# Altium schematic sheet Main_MCU.SchDoc
size A; SheetNumber: 2; SheetTotal: 6
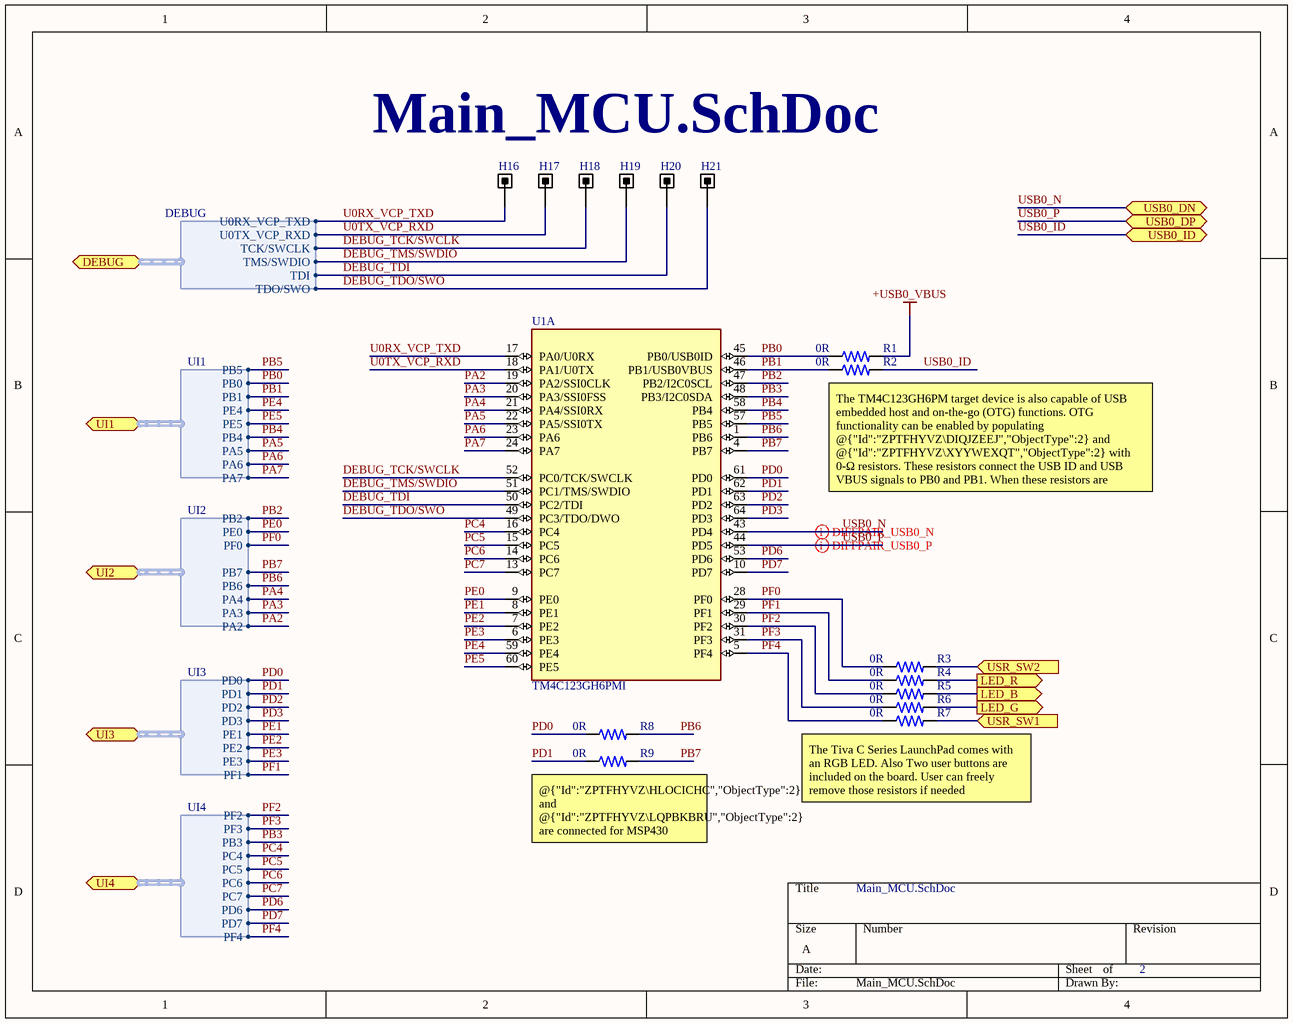
[diagram p0: Main_MCU.SchDoc]

## Parts
H16  Test Point  [Test Point]  (value not drawn)
H17  Test Point  [Test Point]  (value not drawn)
H18  Test Point  [Test Point]  (value not drawn)
H19  Test Point  [Test Point]  (value not drawn)
H20  Test Point  [Test Point]  (value not drawn)
H21  Test Point  [Test Point]  (value not drawn)
R1  0R  [FP-ERA3A-IPC_B]
R2  0R  [FP-ERA3A-IPC_B]
R3  0R  [FP-ERA3A-IPC_B]
R4  0R  [FP-ERA3A-IPC_B]
R5  0R  [FP-ERA3A-IPC_B]
R6  0R  [FP-ERA3A-IPC_B]
R7  0R  [FP-ERA3A-IPC_B]
R8  0R  [0402 RES]
R9  0R  [0402 RES]
U1  TM4C123GH6PMI  [QFP50P1200X1200X160-64N]  (part A of 2)

## Ports
DEBUG (bidir, harness DEBUG, see Master[2B], In-Circuit_Debug_Interface[1B]), LED_B (out, see Master[2B], LEDS_SWITCHS[1A]), LED_G (out, see Master[2B], LEDS_SWITCHS[1B]), LED_R (out, see Master[2B], LEDS_SWITCHS[1A]), UI1 (bidir, harness UI1, see Master[2C], Connectors[1C]), UI2 (bidir, harness UI2, see Master[2C], Connectors[4C]), UI3 (bidir, harness UI3, see Master[2C], Connectors[2D]), UI4 (bidir, harness UI4, see Master[2C], Connectors[3C]), USB0_DN (bidir, see Master[2C], Connectors[1A]), USB0_DP (bidir, see Master[2C], Connectors[1A]), USB0_ID (bidir, see Master[2C], Connectors[1A]), USR_SW1 (in, see Master[2C], LEDS_SWITCHS[4B]), USR_SW2 (in, see Master[2C], LEDS_SWITCHS[4B])

## Harnesses
DEBUG: U0RX_VCP_TXD, U0TX_VCP_RXD, TCK/SWCLK, TMS/SWDIO, TDI, TDO/SWO
UI1: PB5, PB0, PB1, PE4, PE5, PB4, PA5, PA6, PA7
UI2: PB2, PE0, PF0, PB7, PB6, PA4, PA3, PA2
UI3: PD0, PD1, PD2, PD3, PE1, PE2, PE3, PF1
UI4: PF2, PF3, PB3, PC4, PC5, PC6, PC7, PD6, PD7, PF4

## Nets
+USB0_VBUS: R1.2
DEBUG_TCK/SWCLK: H18.1 U1.52(PC0/TCK/SWCLK) ; port DEBUG.TCK/SWCLK
DEBUG_TDI: H20.1 U1.50(PC2/TDI) ; port DEBUG.TDI
DEBUG_TDO/SWO: H21.1 U1.49(PC3/TDO/DWO) ; port DEBUG.TDO/SWO
DEBUG_TMS/SWDIO: H19.1 U1.51(PC1/TMS/SWDIO) ; port DEBUG.TMS/SWDIO
LED_B: R5.2 ; port LED_B
LED_G: R6.2 ; port LED_G
LED_R: R4.2 ; port LED_R
PA2: U1.19(PA2/SSI0CLK) ; port UI2.PA2
PA3: U1.20(PA3/SSI0FSS) ; port UI2.PA3
PA4: U1.21(PA4/SSI0RX) ; port UI2.PA4
PA5: U1.22(PA5/SSI0TX) ; port UI1.PA5
PA6: U1.23(PA6) ; port UI1.PA6
PA7: U1.24(PA7) ; port UI1.PA7
PB0: R1.1 U1.45(PB0/USB0ID) ; port UI1.PB0
PB1: R2.1 U1.46(PB1/USB0VBUS) ; port UI1.PB1
PB2: U1.47(PB2/I2C0SCL) ; port UI2.PB2
PB3: U1.48(PB3/I2C0SDA) ; port UI4.PB3
PB4: U1.58(PB4) ; port UI1.PB4
PB5: U1.57(PB5) ; port UI1.PB5
PB6: R8.2 U1.1(PB6) ; port UI2.PB6
PB7: R9.2 U1.4(PB7) ; port UI2.PB7
PC4: U1.16(PC4) ; port UI4.PC4
PC5: U1.15(PC5) ; port UI4.PC5
PC6: U1.14(PC6) ; port UI4.PC6
PC7: U1.13(PC7) ; port UI4.PC7
PD0: R8.1 U1.61(PD0) ; port UI3.PD0
PD1: R9.1 U1.62(PD1) ; port UI3.PD1
PD2: U1.63(PD2) ; port UI3.PD2
PD3: U1.64(PD3) ; port UI3.PD3
PD6: U1.53(PD6) ; port UI4.PD6
PD7: U1.10(PD7) ; port UI4.PD7
PE0: U1.9(PE0) ; port UI2.PE0
PE1: U1.8(PE1) ; port UI3.PE1
PE2: U1.7(PE2) ; port UI3.PE2
PE3: U1.6(PE3) ; port UI3.PE3
PE4: U1.59(PE4) ; port UI1.PE4
PE5: U1.60(PE5) ; port UI1.PE5
PF0: R3.1 U1.28(PF0) ; port UI2.PF0
PF1: R4.1 U1.29(PF1) ; port UI3.PF1
PF2: R5.1 U1.30(PF2) ; port UI4.PF2
PF3: R6.1 U1.31(PF3) ; port UI4.PF3
PF4: R7.1 U1.5(PF4) ; port UI4.PF4
U0RX_VCP_TXD: H16.1 U1.17(PA0/U0RX) ; port DEBUG.U0RX_VCP_TXD
U0TX_VCP_RXD: H17.1 U1.18(PA1/U0TX) ; port DEBUG.U0TX_VCP_RXD
USB0_ID: R2.2 ; port USB0_ID
USB0_N: U1.43(PD4) ; port USB0_DN
USB0_P: U1.44(PD5) ; port USB0_DP
USR_SW1: R7.2 ; port USR_SW1
USR_SW2: R3.2 ; port USR_SW2

## Layout directives
differential pair; differential pair class USB: USB0_N, USB0_P

## Notes on the sheet
- (near R2) The TM4C123GH6PM target device is also capable of USB embedded host and on-the-go (OTG) functions. OTG functionality can be enabled by populating @{"Id":"ZPTFHYVZ\DIQJZEEJ","ObjectType":2} and @{"Id":"ZPTFHYVZ\XYYWEXQT","ObjectType":2} with 0-Ω resistors. These resistors connect the USB ID and USB VBUS signals to PB0 and PB1. When these resistors are populated, PB0 and PB1 must remain in the respective USB pin mode configurations to prevent device damage.
- (near R9) @{"Id":"ZPTFHYVZ\HLOCICHC","ObjectType":2} and @{"Id":"ZPTFHYVZ\LQPBKBRU","ObjectType":2} are connected for MSP430 BoosterPack Interface Compatability. User can remove them if needed
- (near R7) The Tiva C Series LaunchPad comes with an RGB LED. Also Two user buttons are included on the board. User can freely remove those resistors if needed

## Library data of the parts
R1-R7 = 0603 SMD RES: Fixed Resistor, Metal Glaze/thick Film, 0.1W, 0ohm, Surface Mount, 0603; Manufacturer: Panasonic; Manufacturer Part Number: ERJ-3GEY0R00V; Power: 100mW; Rated Temperature: 70°C; Package Height: 0.45mm; Package Length: 1.6mm; Package Width: 0.8mm; Reference Standard: AEC-Q200; Supplier: Mouser; Supplier Part Number: 667-ERJ-3GEY0R00V; RoHS: Yes; Category: Chip SMD Resistors; Stock: 3258844; Pricing: 1=0.1, 10=0.022, 50=0.022, 100=0.01, 1000=0.008, 10000=0.004 (USD); Mounting Technology: Surface Mount; Pins: 2; Package Shape: Rectangular; Case/Package: 0603; Terminal Finish: Nickel; Min Operating Temperature: -55°C; Max Operating Temperature: 155°C; JESD-609 Code: e3; Resistor Type: FIXED RESISTOR; Construction: Rectangular; Packaging: Tape and Reel; Value: 0R; Technology: METAL GLAZE/THICK FILM; Termination: Wraparound; Reach SVHC Compliant: Yes; RoHS Compliant: Yes; ComponentLink1URL: https://datasheet.ciiva.com:443/pdfs/VipMasterIC/IC/PANA/PANA-S-A0009459603/PANA-S-A0009459603-1.pdf?src-supplier=IHS+Markit; ComponentLink1Description: https://datasheet.ciiva.com:443/pdfs/VipMasterIC/IC/PANA/PANA-S-A0009459603/PANA-S-A0009459603-1.pdf?src-supplier=IHS+Markit; ComponentLink2URL: https://datasheet.ciiva.com/27055/1935748-27055113.pdf?src-supplier=Jameco; ComponentLink2Description: https://datasheet.ciiva.com/27055/1935748-27055113.pdf?src-supplier=Jameco; ComponentLink3URL: https://datasheet.ciiva.com/11808/0900766b80f806dd-11808207.pdf?src-supplier=Rs; ComponentLink3Description: https://datasheet.ciiva.com/11808/0900766b80f806dd-11808207.pdf?src-supplier=Rs; ComponentLink4URL: https://datasheet.ciiva.com/46377/1678796-46377868.pdf?src-supplier=Element14; ComponentLink4Description: https://datasheet.ciiva.com/46377/1678796-46377868.pdf?src-supplier=Element14; ComponentLink5URL: https://datasheet.ciiva.com/9198/aoa0000ce1-9198975.pdf?src-supplier=Avnet; ComponentLink5Description: https://datasheet.ciiva.com/9198/aoa0000ce1-9198975.pdf?src-supplier=Avnet; ComponentLink6URL: https://datasheet.ciiva.com/16834/aoa0000ce1-16834828.pdf?src-supplier=Future+Electronics; ComponentLink6Description: https://datasheet.ciiva.com/16834/aoa0000ce1-16834828.pdf?src-supplier=Future+Electronics; ComponentLink7URL: https://datasheet.ciiva.com/30199/4aoa0000ce1-30199822.pdf?src-supplier=Onlinecomponents.com; ComponentLink7Description: https://datasheet.ciiva.com/30199/4aoa0000ce1-30199822.pdf?src-supplier=Onlinecomponents.com; ComponentLink8URL: https://datasheet.ciiva.com/43460/1678796-43460647.pdf?src-supplier=Farnell; ComponentLink8Description: https://datasheet.ciiva.com/43460/1678796-43460647.pdf?src-supplier=Farnell; ComponentLink9URL: https://datasheet.ciiva.com/5959/1678796-5959707.pdf?src-supplier=Farnell; ComponentLink9Description: https://datasheet.ciiva.com/5959/1678796-5959707.pdf?src-supplier=Farnell; ComponentLink10URL: https://datasheet.ciiva.com/28695/1678796-28695833.pdf?src-supplier=Element14; ComponentLink10Description: https://datasheet.ciiva.com/28695/1678796-28695833.pdf?src-supplier=Element14; ComponentLink11URL: https://datasheet.ciiva.com/16758/70255313-16758527.pdf?src-supplier=Allied+Electronics; ComponentLink11Description: https://datasheet.ciiva.com/16758/70255313-16758527.pdf?src-supplier=Allied+Electronics; ComponentLink12URL: https://datasheet.ciiva.com/48532/aoa0000ce1-48532165.pdf?src-supplier=Avnet; ComponentLink12Description: https://datasheet.ciiva.com/48532/aoa0000ce1-48532165.pdf?src-supplier=Avnet
R8 R9 = 0402 SMD Resistor: Metal Glaze/thick Film, 0.0625W, 0ohm, Surface Mount, 0402; Manufacturer: Yageo; Manufacturer Part Number: RC0402JR-070RL; Power: 62.5mW; Rated Temperature: 70°C; Package Height: 0.35mm; Package Length: 1mm; Package Width: 0.5mm; ComponentLink1Description: Link; ComponentLink1URL: *; Supplier: Future Electronics; Supplier Part Number: 3375797; RoHS: Yes; Category: Chip SMD Resistors; Stock: 16470000; Pricing: 10000=0.0011, 50000=0.0011, 250000=0.001, 500000=0.001, 1500000=0.0009 (USD); Mounting Technology: Surface Mount; Pins: 2; Package Shape: Rectangular; Case/Package: 0402; Terminal Finish: Nickel; Min Operating Temperature: -55°C; Max Operating Temperature: 155°C; JESD-609 Code: e3; Resistor Type: FIXED RESISTOR; Packaging: Tape and Reel; Value: 0R; Technology: METAL GLAZE/THICK FILM; Termination: Wraparound; Construction: Chip; Reach SVHC Compliant: Yes; RoHS Compliant: Yes; ComponentLink2URL: https://datasheet.ciiva.com:443/pdfs/VipMasterIC/IC/YAGO/YAGO-S-A0008145938/YAGO-S-A0008145938-1.pdf?src-supplier=IHS+Markit; ComponentLink2Description: https://datasheet.ciiva.com:443/pdfs/VipMasterIC/IC/YAGO/YAGO-S-A0008145938/YAGO-S-A0008145938-1.pdf?src-supplier=IHS+Markit
U1 = TM4C123GH6PMI: ARMÂ® CortexÂ®-M4F Tivaâ„¢ C Microcontroller IC 32-Bit 80MHz 256KB _256K x 8_ FLASH 64-LQFP _10x10_; MF: Texas Instruments; Price: None; Availability: Unavailable; SnapEDA_Link: https://www.snapeda.com/parts/TM4C123GH6PMI/Texas%20Instruments/view-part/557012/?ref=snap; Value: *; Package: LQFP-64 Texas Instruments; MP: TM4C123GH6PMI